# EAGLE design RH025.1 (EAGLE 7.1.0)
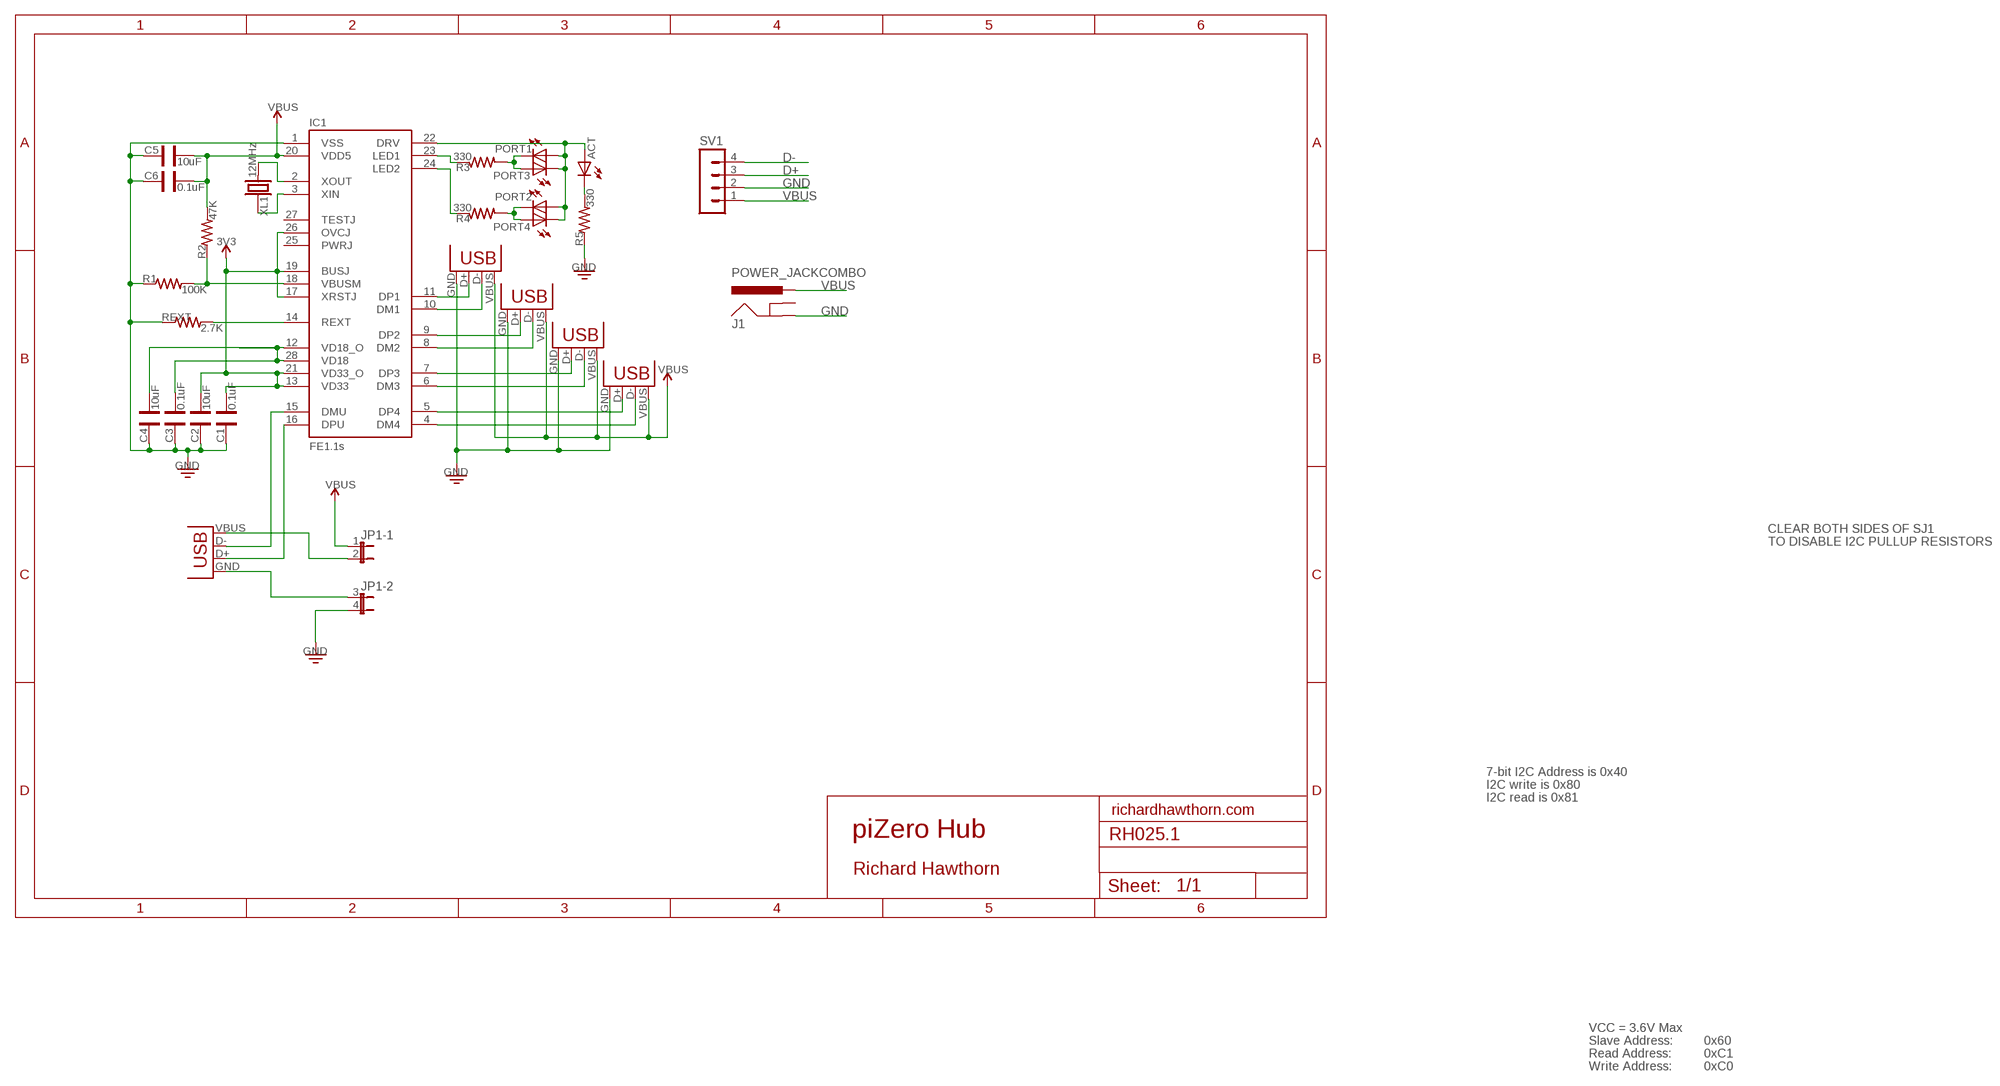
[diagram p0: schematic, sheet 1]

## Parts
ACT  LED0603  [LED-0603]
C1  0.1uF  CAP0603  [CAP-0603]
C2  10uF  CAP0603  [CAP-0603]
C3  0.1uF  CAP0603  [CAP-0603]
C4  10uF  CAP0603  [CAP-0603]
C5  10uF  CAP0603  [CAP-0603]
C6  0.1uF  CAP0603  [CAP-0603]
IC1  FE1.1S  [FE1.1S_SSOP-28]
J1  POWER_JACKCOMBO  [POWER_JACK_COMBO]
JP1  JP2QE  [JP2Q]
PORT1  LED0603  [LED-0603]
PORT2  LED0603  [LED-0603]
PORT3  LED0603  [LED-0603]
PORT4  LED0603  [LED-0603]
R1  100K  RES0603  [RES-0603]
R2  47K  RES0603  [RES-0603]
R3  330  RES0603  [RES-0603]
R4  330  RES0603  [RES-0603]
R5  330  RES0603  [RES-0603]
REXT  2.7K  RES0603  [RES-0603]
SV1  MA04-1  [MA04-1]
USB1  USBMICROB-PTH  [USB-MICROB-TH]
USB2  USBA-PTH  [USB-A-F-PTH]
USB3  USBA-PTH  [USB-A-F-PTH]
USB4  USBA-PTH  [USB-A-F-PTH]
USB5  USBA-PTH  [USB-A-F-PTH]
XL1  12MHz  CRYSTALHC49UP  [HC49UP]

## Nets
3V3: C1.1 C2.1 IC1.13(VD33) IC1.17(XRSTJ) IC1.19(BUSJ) IC1.21(VD33_O) IC1.26(OVCJ)
D+: IC1.16(DPU) SV1.3 USB1.D+
D-: IC1.15(DMU) SV1.4 USB1.D-
GND: C1.2 C2.2 C3.2 C4.2 C5.2 C6.2 IC1.1(VSS) J1.GND@1(GND) JP1.4 R1.1 R5.1 REXT.1 SV1.2 USB2.GND USB3.GND USB4.GND USB5.GND
N$1: IC1.14(REXT) REXT.2
N$3: JP1.2 USB1.VBUS
N$4: JP1.3 USB1.GND
N$6: PORT2.C PORT4.A R4.2
N$7: IC1.2(XOUT) XL1.2
N$8: C3.1 C4.1 IC1.12(VD18_O) IC1.28(VD18)
N$9: IC1.3(XIN) XL1.1
N$11: IC1.11(DP1) USB5.D+
N$12: IC1.10(DM1) USB5.D-
N$13: IC1.18(VBUSM) R1.2 R2.1
N$14: IC1.9(DP2) USB4.D+
N$15: IC1.8(DM2) USB4.D-
N$16: IC1.7(DP3) USB3.D+
N$17: IC1.6(DM3) USB3.D-
N$18: IC1.5(DP4) USB2.D+
N$19: IC1.4(DM4) USB2.D-
N$20: PORT1.C PORT3.A R3.2
N$22: ACT.C R5.2
N$23: IC1.23(LED1) R3.1
N$24: IC1.24(LED2) R4.1
N$25: ACT.A IC1.22(DRV) PORT1.A PORT2.A PORT3.C PORT4.C
VBUS: C5.1 C6.1 IC1.20(VDD5) J1.POWER(PWR) JP1.1 R2.2 SV1.1 USB2.VBUS USB3.VBUS USB4.VBUS USB5.VBUS
Unconnected: IC1.25(PWRJ) IC1.27(TESTJ) J1.GND(GNDBREAK)

## Notes on the sheet
- CLEAR BOTH SIDES OF SJ1
- TO DISABLE I2C PULLUP RESISTORS
- 7-bit I2C Address is 0x40
- I2C write is 0x80
- I2C read is 0x81
- richardhawthorn.com
- piZero Hub
- Richard Hawthorn
- VCC = 3.6V Max
- Slave Address: | 0x60
- Read Address: | 0xC1
- Write Address: | 0xC0

## Library data of the parts
ACT PORT1-PORT4 = Ai_LED:LED
C1-C6 = Ai_Passives:CAP
IC1 = Ai_IC:FE1.1S
J1 = SparkFun-Connectors:POWER_JACK: Power Jack This is the standard 5.5mm barrel jack for power. The PTH is the most common, proven, reliable, footprint. The Slot footprint only works if the mill layer is transmitted to the PCB fab house so be warned. Mating wall wart : TOL-00298 (and others)
JP1 = jumper:JP2QE: JUMPER
R1-R5 REXT = Ai_Passives:RES: Part # blah Digikey
SV1 = con-lstb:MA04-1: PIN HEADER; OC_FARNELL: unknown; OC_NEWARK: unknown
USB1-USB5 = Ai_Connectors:USB
XL1 = Ai_FrequencyControl:CRYSTAL: PTH: ... SMD: ... Cylinder: CMR200T-32.768KDZBT

## Net classes
1 power: width 0.381 mm, clearance 0.254 mm

## Board
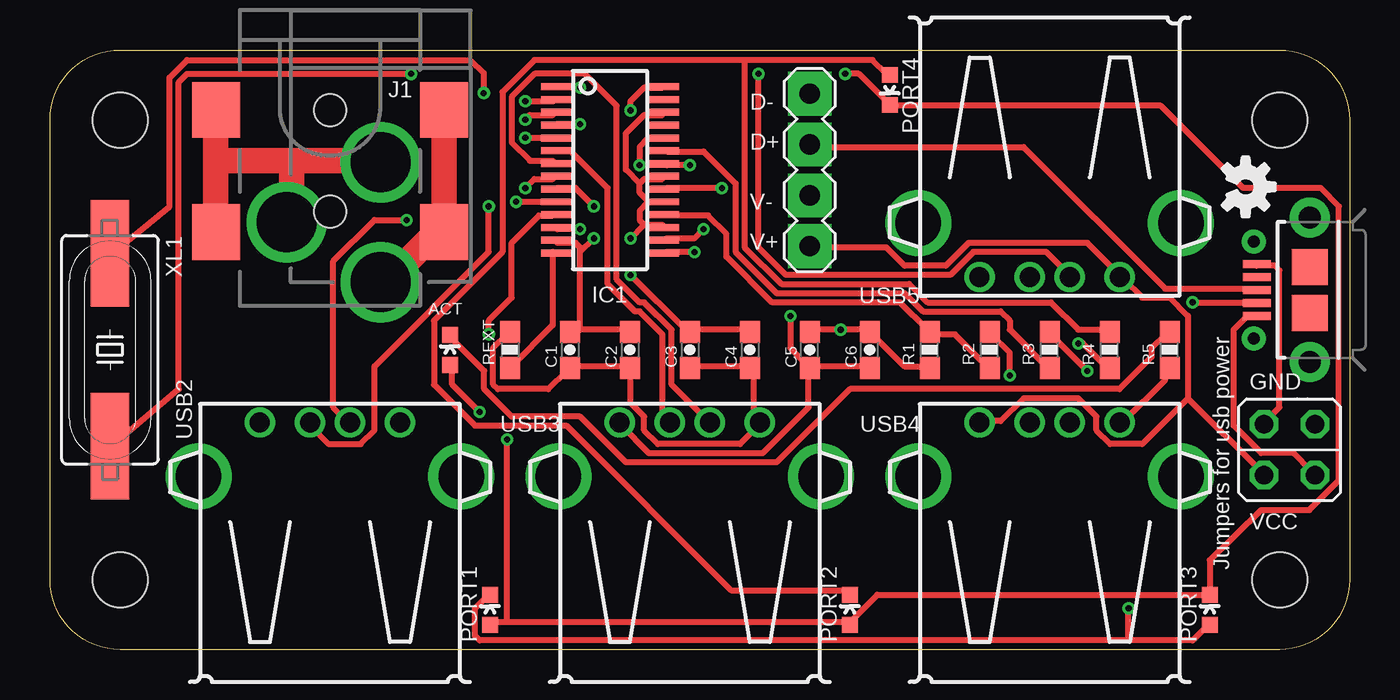
[diagram p1: board, top side]
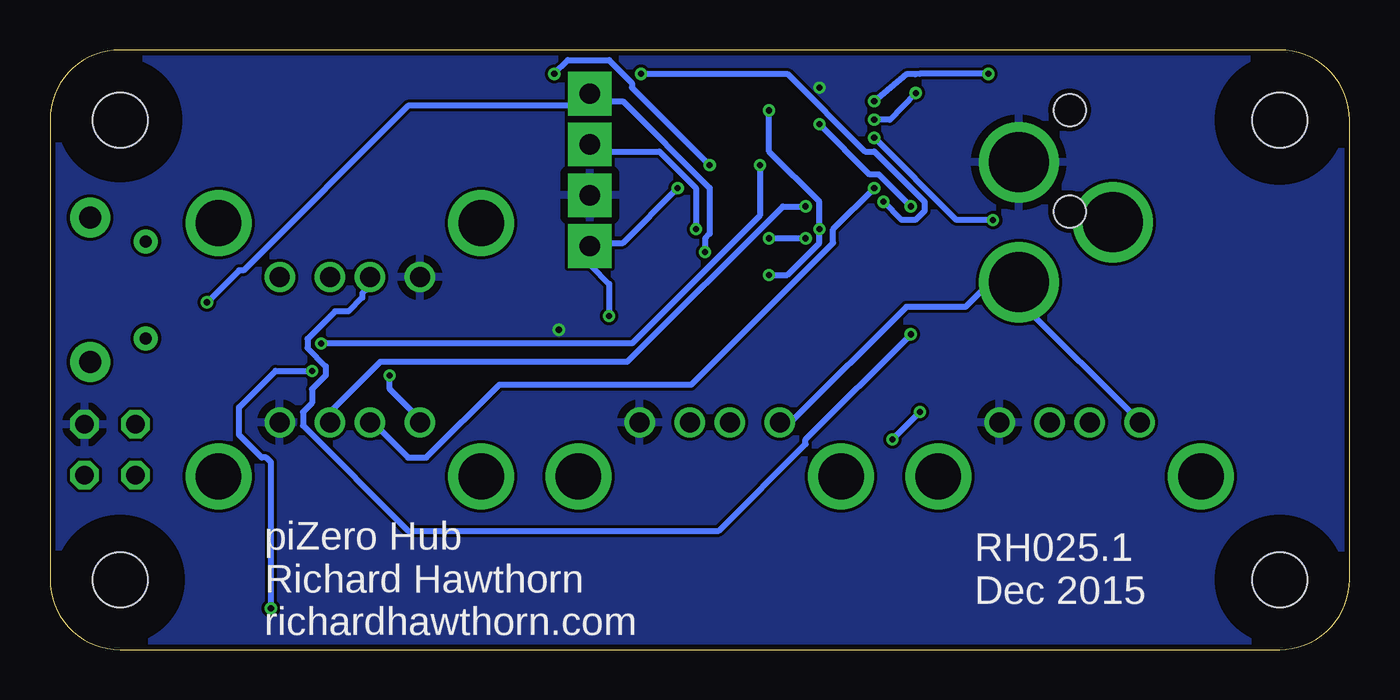
[diagram p2: board, bottom side, seen from below]

Size 65 x 30 mm. Coordinates in mm from the lower left corner, seen from the top.
Outline: 0,3.5 0,26.5 arc-90 3.5,30 61.5,30 arc-90 65,26.5 65,3.5 arc-90 61.5,0 3.5,0 arc-90 0,3.5
Copper layers (1*16): Top 0.035mm / dielectric 1.5mm / Bottom 0.035mm
Design rules "ITEADstudio_DRC *": minimum track width 12mil, minimum drill 12mil, track to track 6mil, track to pad 6mil, pad to pad 6mil, via to via 6mil, smd to smd 0mil, copper to edge 10mil, drill to drill 10mil, minimum pad ring 10mil, minimum via ring 6mil, stop-mask expansion 2mil, vias tented up to drill 100mil, thermal gap 15mil
Holes 2.75 mm at 3.5,3.5 61.5,3.5 3.5,26.5 61.5,26.5
bRestrict: area 0.5,0.5 to 6.5,6.5; area 0.5,23.5 to 6.5,29.5; area 58.6,23.6 to 64.4,29.4; area 58.5,0.5 to 64.5,6.5

### Footprints (pad centres in the part's own frame; a part is rotated, then mirrored left to right if it is on the bottom)
LED-0603 = smd 0.8 x 0.8: A 0,-0.75; C 0,0.75
CAP-0603 = smd 1.1 x 1: 1 -0.9,0; 2 0.9,0
FE1.1S_SSOP-28 = smd 0.35 x 1.5: 1 -4.16,-2.7; 2 -3.52,-2.7; 3 -2.88,-2.7; 4 -2.24,-2.7; 5 -1.6,-2.7; 6 -0.96,-2.7; 7 -0.32,-2.7; 8 0.32,-2.7; 9 0.96,-2.7; 10 1.6,-2.7; 11 2.24,-2.7; 12 2.88,-2.7; 13 3.52,-2.7; 14 4.16,-2.7; 15 4.16,2.7; 16 3.52,2.7; 17 2.88,2.7; 18 2.24,2.7; 19 1.6,2.7; 20 0.96,2.7; 21 0.32,2.7; 22 -0.3,2.7; 23 -0.96,2.7; 24 -1.6,2.7; 25 -2.24,2.7; 26 -2.88,2.7; 27 -3.52,2.7; 28 -4.16,2.7
POWER_JACK_COMBO = drill 2.997: GND 5.62,-2.16; GND@1 2.62,2.54; POWER 8.62,2.54 | smd 2.8 x 2.4: GND@3 0,-5.7; GND@4 6.1,-5.7; POWER@1 0,5.7; POWER@2 6.1,5.7 | hole 1.6: 0,0; 5.08,0
JP2Q = drill 0.914 octagon: 1 -1.27,-1.27; 2 1.27,-1.27; 3 -1.27,1.27; 4 1.27,1.27
RES-0603 = smd 1.1 x 1: 1 -0.9,0; 2 0.9,0
MA04-1 = drill 1.016 pad 2.184 square: 1 -3.81,0; 2 -1.27,0; 3 1.27,0; 4 3.81,0
USB-MICROB-TH = smd 0.4 x 1.4: D+ 0,2.65; D- -0.65,2.65; GND 1.3,2.65; ID 0.65,2.65; VBUS -1.3,2.65 | smd 1.8 x 1.8: M5 -1.15,0; M6 1.15,0 | drill 0.6 pad 1.2: MT1 -2.425,2.8; MT2 2.425,2.8 | drill 1.1 pad 2: MT3 -3.61,0; MT4 3.61,0
USB-A-F-PTH = drill 1: D+ 1,5.37; D- -1,5.37; GND 3.5,5.37; VBUS -3.5,5.37 | drill 2.286: P$1 -6.57,2.66; P$2 6.57,2.66
HC49UP = smd 5.334 x 1.93: 1 -4.826,0; 2 4.826,0

### Placement (x,y rotation side)
ACT  20,15 0 top
C1  26,15 270 top
C2  29,15 270 top
C3  32,15 270 top
C4  35,15 270 top
C5  38,15 90 top
C6  41,15 90 top
IC1  28,24 270 top
J1  14,27 270 top
JP1  62,10 0 top
PORT1  22,2 0 top
PORT2  40,2 0 top
PORT3  58,2 0 top
PORT4  42,28 180 top
R1  44,15 90 top
R2  47,15 90 top
R3  50,15 90 top
R4  53,15 90 top
R5  56,15 90 top
REXT  23,15 270 top
SV1  38,24 90 top
U$3  [OSHW-LOGO-S]  59.8,23.15 270 top
USB1  63,18 90 top
USB2  14,6 0 top
USB3  32,6 0 top
USB4  50,6 0 top
USB5  50,24 180 top
XL1  3,15 270 top

### Tracks (layer width: path | path; a pad name or v marks a point on that pad's centre or on a via)
3V3  (via drill 0.3)
  Top 0.305: 29.72,21.26 30.63,21.26 IC1.17 | 29.72,21.26 29.49,21.49 29.49,21.95 29.95,22.4 | 29.95,22.4 30.63,22.4 IC1.19 | 29.49,23.32 29.72,23.55 30.63,23.55 IC1.21 | 29.49,23.32 29.49,22.86 29.95,22.4 | 29.49,23.32 28.8,24 28.8,25.83 29.72,26.75 30.63,26.75 IC1.26 | 26.52,16 28.8,16 C2.1 | 26.52,16 26.06,16 C1.1 | 26.52,16 26.52,19.89 | 26.52,19.89 26.52,20.12 26.29,20.34 25.38,20.34 IC1.13 | v29.03,20.57 29.72,21.26 | 26.52,19.89 v27.2,20.57
  Bottom 0.305: v27.2,20.57 v29.03,20.57
D+  (via drill 0.3)
  Top 0.305: USB1.D+ 60.12,18.06 55.78,18.06 48.69,25.15 38.18,25.15 SV1.3 | v32.69,21.03 32.23,20.57 30.86,20.57 IC1.16
  Bottom 0.305: v32.69,21.03 32.69,23.09 34.52,24.92 37.72,24.92 37.95,25.15 SV1.3
D-  (via drill 0.3)
  Top 0.305: v57.15,17.37 60.12,17.37 USB1.D- | v32.23,19.89 30.86,19.89 IC1.15
  Bottom 0.305: v57.15,17.37 55.55,18.97 55.32,18.97 47.09,27.2 38.63,27.2 38.18,27.66 SV1.4 37.95,27.66 37.72,27.43 36.35,27.43 32,23.09 32,20.8 32.23,20.57 v32.23,19.89
GND  (via drill 0.3)
  Top 0.305: REXT.1 22.86,15.77 22.17,15.09 22.17,13.26 22.4,13.03 24.92,13.03 25.83,13.95 C1.2 26.06,14.17 28.8,14.17 C2.2 29.03,13.95 29.03,12.34 29.72,11.66 29.72,10.97 30.4,10.29 34.52,10.29 35.43,11.2 USB3.GND 35.43,11.43 35.2,11.66 35.2,13.95 C4.2 34.98,14.17 32,14.17 C3.2 | C5.2 38.18,16 v39.55,16 40.92,16 C6.2 41.15,15.77 42.75,14.17 43.89,14.17 R1.1 | R5.1 55.78,13.95 55.78,13.49 53.72,11.43 USB4.GND | v26.52,28.12 25.38,28.12 IC1.1
  pour Bottom: 0,30 0,0 65,0 65,30
N$1
  Top 0.305: REXT.2 23.09,14.17 25.15,16.23 25.15,19.89 IC1.14
N$3
  Top 0.305: USB1.VBUS 60.12,16.69 59.89,16.69 59.21,16 59.21,11.2 60.58,9.83 62.18,9.83 63.09,8.91 JP1.2
N$4
  Top 0.305: USB1.GND 60.35,19.2 61.27,19.2 61.49,18.97 61.49,12.12 60.81,11.43 JP1.3
N$6
  Top 0.305: 34.75,29.49 41.15,29.49 41.83,28.8 PORT4.A | 34.75,29.49 24.23,29.49 22.63,27.89 22.63,19.89 19.2,16.46 19.2,13.26 21.26,11.2 25.83,11.2 34.06,2.97 39.78,2.97 PORT2.C | 34.75,29.49 34.75,20.12 36.58,18.29 42.98,18.29 43.89,17.37 50.06,17.37 51.44,16 52.81,16 R4.2
N$7  (via drill 0.3)
  Top 0.305: v23.77,27.43 25.15,27.43 IC1.2 | v18.06,28.8 6.86,28.8 6.44,28.39 6.44,13.03 3.2,10.29 XL1.2
  Bottom 0.305: v23.77,27.43 22.17,28.78 21.72,28.78 21.49,28.8 v18.06,28.8
N$8  (via drill 0.3)
  Top 0.305: C4.1 34.98,16 32,16 C3.1 31.77,16 v29.03,18.75 | v26.52,21.03 25.38,21.03 IC1.12 | v29.03,26.98 29.03,27.43 29.72,28.12 30.63,28.12 IC1.28
  Bottom 0.305: v29.03,18.75 28.12,18.75 26.52,20.34 v26.52,21.03 26.52,22.4 29.03,24.92 v29.03,26.98
N$9  (via drill 0.3)
  Top 0.305: v23.77,26.52 24,26.75 25.15,26.75 IC1.3 | v21.7,27.85 21.7,28.85 21,29.49 6.86,29.49 5.99,28.62 5.99,22.17 3.2,19.89 XL1.1
  Bottom 0.305: v21.7,27.85 23,26.5 23,26.52 v23.77,26.52
N$11  (via drill 0.3)
  Top 0.305: v21.95,15.77 21.95,16.46 23.09,17.6 23.09,20.34 24.46,21.72 25.15,21.72 IC1.11
  Bottom 0.305: v21.95,15.77 27.2,10.52 27.2,10.29 31.55,5.94 47.09,5.94 52.35,11.2 52.35,11.89 51.89,12.34 51.89,13.03 51.21,13.72 51.21,14.17 52.12,15.09 52.12,15.54 50.75,16.92 50.06,16.92 49.38,17.6 49.38,17.83 49.15,18.06 49.15,18.52 USB5.D+
N$12  (via drill 0.3)
  Top 0.305: v23.32,22.4 25.15,22.4 IC1.10 | v35.43,28.8 35.43,20.12 36.8,18.75 45.03,18.75 46.18,19.89 49.84,19.89 50.98,18.75 USB5.D-
  Bottom 0.305: v23.32,22.4 22.4,21.49 21.72,21.49 21.26,21.95 21.26,22.4 23.77,24.92 24.23,24.92 28.12,28.8 v35.43,28.8
N$13
  Top 0.305: R2.1 46.86,14.17 45.26,15.77 44.12,15.77 R1.2 43.89,16 42.52,17.37 36.12,17.37 33.83,19.66 33.83,20.8 32.92,21.72 30.86,21.72 IC1.18
N$14  (via drill 0.3)
  Top 0.305: v27.2,22.17 26.29,23.09 25.38,23.09 IC1.9
  Bottom 0.305: v27.2,22.17 28.35,22.17 36.12,14.4 48.46,14.4 50.98,11.89 50.98,11.43 USB4.D+
N$15  (via drill 0.3)
  Top 0.305: v23.77,23.09 24.23,23.55 25.15,23.55 IC1.8
  Bottom 0.305: v23.77,23.09 25.83,21.03 25.83,20.34 32.92,13.26 42.52,13.26 46.18,9.6 47.09,9.6 48.92,11.43 USB4.D-
N$16
  Top 0.305: IC1.7 25.15,24.46 24,24.46 23.09,25.38 23.09,27.66 24.23,28.8 26.75,28.8 28.35,27.2 28.35,18.52 29.49,17.37 29.72,17.37 31.09,16 31.09,13.26 32.92,11.43 USB3.D+
N$17
  Top 0.305: IC1.6 25.38,24.92 26.06,24.92 27.89,23.09 27.89,18.29 29.26,16.92 29.49,16.92 30.63,15.77 30.63,11.66 30.86,11.43 USB3.D-
N$18  (via drill 0.3)
  Top 0.305: v23.77,25.6 25.15,25.6 IC1.5 | v17.83,21.49 16.23,21.49 14.17,19.43 14.17,12.12 14.86,11.43 USB2.D+
  Bottom 0.305: v23.77,25.6 19.66,21.49 v17.83,21.49
N$19  (via drill 0.3)
  Top 0.305: v26.52,26.29 25.38,26.29 IC1.4 | v21.95,22.17 21.95,19.89 16.23,14.17 16.23,10.97 15.54,10.29 13.95,10.29 13.03,11.2 USB2.D-
  Bottom 0.305: v26.52,26.29 24,23.77 23.55,23.77 v21.95,22.17
N$20  (via drill 0.3)
  Top 0.305: 53.95,0.46 57.15,0.46 57.84,1.14 PORT3.A | 53.95,0.46 21.49,0.46 21.26,0.69 21.26,2.06 21.95,2.74 PORT1.C | v51.89,13.95 50.06,15.77 R3.2 | 53.95,0.46 v53.95,2.06
  Bottom 0.305: v51.89,13.95 53.72,13.95 55.55,12.12 55.55,10.74 54.41,9.6 54.18,9.6 53.95,9.37 v53.95,2.06
N$22
  Top 0.305: ACT.C 20.12,15.54 21.72,13.95 21.72,13.03 23.09,11.66 26.52,11.66 28.8,9.37 36.35,9.37 40.01,13.03 53.49,13.03 55.09,14.63 55.09,15.09 55.78,15.77 R5.2
N$23
  Top 0.305: R3.1 49.84,14.17 48.01,16 48.01,16.46 47.55,16.92 43.66,16.92 42.75,17.83 36.35,17.83 34.29,19.89 34.29,23.32 32.69,24.92 30.86,24.92 IC1.23
N$24  (via drill 0.3)
  Top 0.305: v51.44,15.32 51.66,15.32 52.81,14.17 R4.1 | v29.49,24.23 29.49,25.15 29.95,25.6 30.63,25.6 IC1.24
  Bottom 0.305: v51.44,15.32 35.89,15.32 29.49,21.72 v29.49,24.23
N$25  (via drill 0.3)
  Top 0.305: 22.86,1.37 39.78,1.37 PORT2.A 40.01,1.37 41.38,2.74 57.84,2.74 PORT3.C 58,4.47 60.58,6.99 62.99,6.99 64.47,8.46 64.47,22.17 63.55,23.09 59.68,23.09 55.56,27.2 42.06,27.2 PORT4.C 41.83,27.43 40.46,28.8 v39.78,28.8 | 22.86,1.37 22.17,1.37 PORT1.A | v21.49,11.89 20.12,13.26 20.12,14.17 ACT.A | 22.86,1.37 v22.86,10.52 | v32,24.23 30.86,24.23 IC1.22
  Bottom 0.305: v22.86,10.52 v21.49,11.89 | v32,24.23 35.89,28.12 35.89,28.35 37.03,29.49 39.09,29.49 v39.78,28.8
VBUS  (via drill 0.3)
  Top 0.305: C5.1 38.18,14.17 40.92,14.17 C6.1 | C5.1 37.95,13.95 37.95,12.12 35.66,9.83 29.95,9.83 28.57,11.2 USB3.VBUS | v33.6,23.09 30.86,23.09 IC1.20 | v48.01,13.72 48.01,14.86 47.09,15.77 R2.2 | 56.92,12.57 60.58,8.91 JP1.1 | 56.92,12.57 56.92,16.69 56.01,17.6 54.63,17.6 53.72,18.52 USB5.VBUS 53.49,18.75 51.89,20.34 45.95,20.34 44.81,19.2 42.75,19.2 41.83,20.12 38.18,20.12 SV1.1 | 56.92,12.57 54.63,10.29 53.03,10.29 52.35,10.97 52.35,11.66 51.44,12.57 48.69,12.57 47.55,11.43 46.63,11.43 USB4.VBUS | v37.03,16.69 37.03,15.09 37.95,14.17 C5.1
  Bottom 0.305: USB2.VBUS 10.52,11.43 16.46,17.37 16.46,18.29 J1.POWER 16.69,18.29 18.06,18.29 19.2,17.14 22.17,17.14 27.89,11.43 28.35,11.43 USB3.VBUS | v33.6,23.09 36.35,20.34 37.95,20.34 SV1.1 37.95,20.12 37.95,19.2 37.03,18.29 v37.03,16.69 | v48.01,13.72 48.01,13.03 46.41,11.43 USB4.VBUS

### Text on the board
tNames: D- | D+ | V- | V+ | GND | VCC | Jumpers for usb power
bNames: RH025.1 / Dec 2015 | piZero Hub / Richard Hawthorn / richardhawthorn.com
tDocu: REG
Notes: Based on design by @MakerBro, https://acrobotic.com / / This work is licensed under the Creative Commons Attribution-ShareAlike 4.0 International License. / To view a copy of this license, visit http://creativecommons.org/licenses/by-sa/4.0/ / / @richardhawthorn / deluxecapacitor.com